# Altium schematic sheet Hbridge.SchDoc
size A
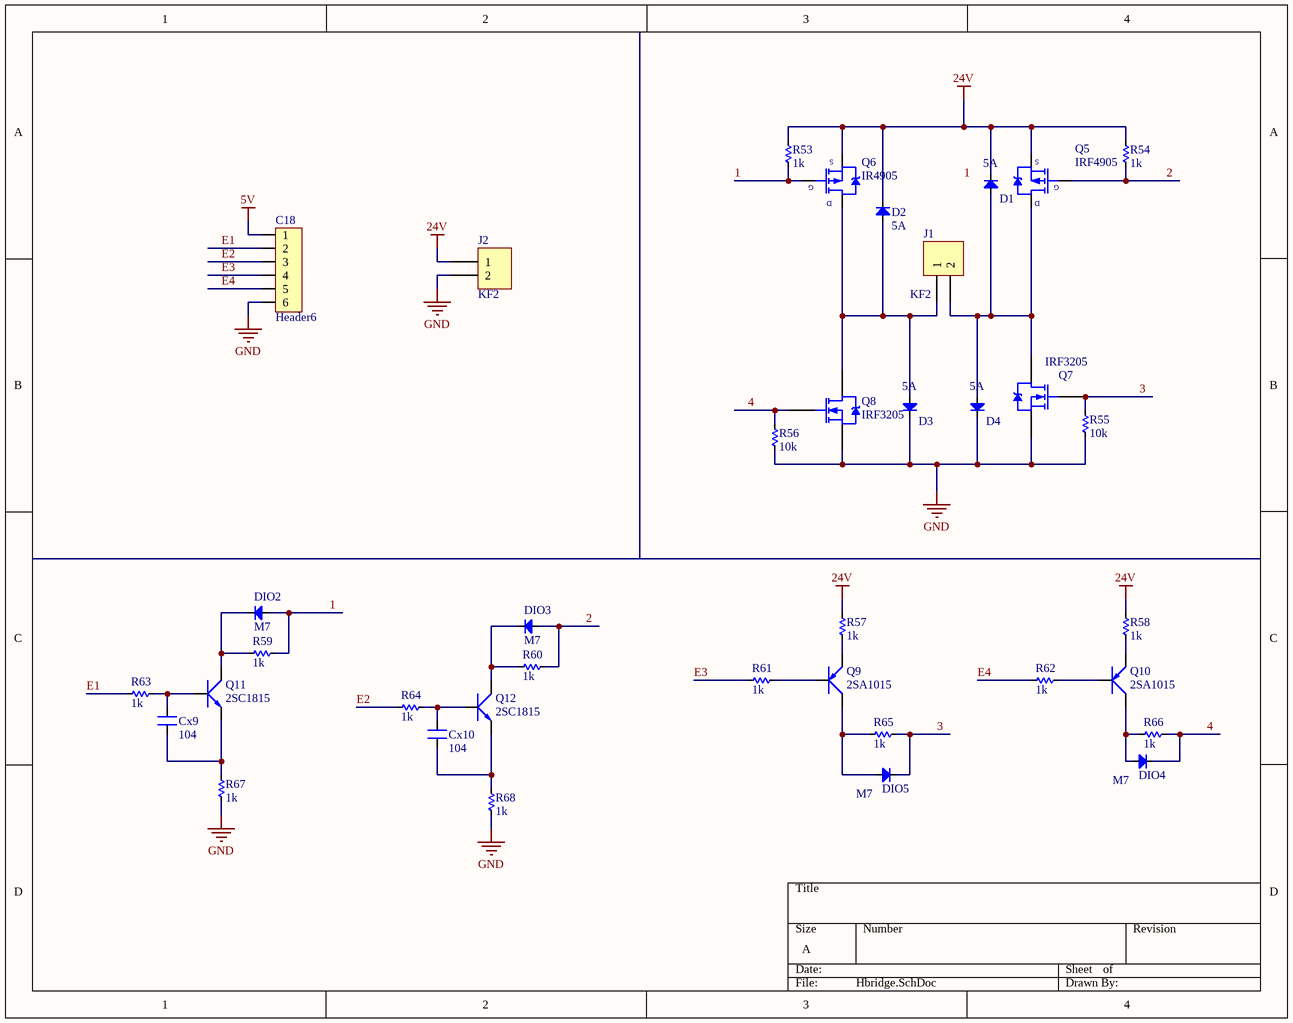
[diagram p0: Hbridge.SchDoc]

## Parts
C18  Header6  [HDR6]
Cx9  104  [CN-SMD-0805]
Cx10  104  [CN-SMD-0805]
D1  5A  [DIO-5A]
D2  5A  [DIO-5A]
D3  5A  [DIO-5A]
D4  5A  [DIO-5A]
DIO2  M7  [DIO-SMD-106]
DIO3  M7  [DIO-SMD-106]
DIO4  M7  [DIO-SMD-106]
DIO5  M7  [DIO-SMD-106]
J1  KF2  [KF2-7.62]
J2  KF2  [KF2-7.62]
Q5  IRF4905  [TO220-123]
Q6  IR4905  [TO220-123]
Q7  IRF3205  [TO220-123]
Q8  IRF3205  [TO220-123]
Q9  2SA1015  [SOT23-321]
Q10  2SA1015  [SOT23-321]
Q11  2SC1815  [SOT23-321]
Q12  2SC1815  [SOT23-321]
R53  1k  [RES-1/4W-SMALL]
R54  1k  [RES-1/4W-SMALL]
R55  10k  [RES-1/4W-SMALL]
R56  10k  [RES-1/4W-SMALL]
R57  1k  [RES-SMD-0805]
R58  1k  [RES-SMD-0805]
R59  1k  [RES-SMD-0805]
R60  1k  [RES-SMD-0805]
R61  1k  [RES-SMD-0805]
R62  1k  [RES-SMD-0805]
R63  1k  [RES-SMD-0805]
R64  1k  [RES-SMD-0805]
R65  1k  [RES-SMD-0805]
R66  1k  [RES-SMD-0805]
R67  1k  [RES-SMD-0805]
R68  1k  [RES-SMD-0805]

## Nets
5V: C18.1
24V: D1.2(K) D2.2(K) J2.1 Q5.3(S) Q6.3(S) R53.1 R54.1 R57.1 R58.1
GND: C18.6 D3.2(K) D4.2(K) J2.2 Q7.3(S) Q8.3(S) R55.2 R56.2 R67.2 R68.2
1: DIO2.1(A) Q6.1(G) R53.2 R59.1
2: DIO3.1(A) Q5.1(G) R54.2 R60.1
3: DIO5.2(K) Q7.1(G) R55.1 R65.1
4: DIO4.2(K) Q8.1(G) R56.1 R66.1
E1: C18.2 R63.2
E2: C18.3 R64.2
E3: C18.4 R61.2
E4: C18.5 R62.2
NetCx9_1: Cx9.1 Q11.1(E) R67.1
NetCx9_2: Cx9.2 Q11.3(B) R63.1
NetCx10_1: Cx10.1 Q12.1(E) R68.1
NetCx10_2: Cx10.2 Q12.3(B) R64.1
NetD1_1: D1.1(A) D4.1(A) J1.2 Q5.2(D) Q7.2(D)
NetD2_1: D2.1(A) D3.1(A) J1.1 Q6.2(D) Q8.2(D)
NetDIO2_2: DIO2.2(K) Q11.2(C) R59.2
NetDIO3_2: DIO3.2(K) Q12.2(C) R60.2
NetDIO4_1: DIO4.1(A) Q10.2(C) R66.2
NetDIO5_1: DIO5.1(A) Q9.2(C) R65.2
NetQ9_1: Q9.1(E) R57.2
NetQ9_3: Q9.3(B) R61.1
NetQ10_1: Q10.1(E) R58.2
NetQ10_3: Q10.3(B) R62.1

## Notes on the sheet
- Labels drawn without touching a wire or pin: 1

## Library data of the parts
C18 = Header6: Header IDC, 6 x 1 Pin Vertical 2.54mm Pitch (Non-Boxed, Male); Manufacturer: W¨¹rth Elektronik eiSos GmbH; partNo: 613002143121; ComponentLink1 Description: Manufacturer; ComponentLink2 Description: Datasheet; NoPins: 02; Created Date: 29 March 2013; ComponentLink1URL: http://www.we-online.com; ComponentLink2URL: http://katalog.we-online.de/em/datasheet/6130xx143121.pdf; Created by: Karrer Zheng
Cx9 Cx10 = CN: Value: 33pF
D1-D4 = Diode: Default Diode TMS; Code - JEDEC: DO-214-AB; Value: 1N5007; Published: 8-Jun-2000; Revision: July-2002: Re-released for DXP Platform.; Publisher: Altium Limited
DIO2-DIO5 = Diode SMD: Default Diode; Code - JEDEC: DO-214-AB; Value: 1N5007; Published: 8-Jun-2000; Revision: July-2002: Re-released for DXP Platform.; Publisher: Altium Limited
J1 J2 = KF2: Manufacturer: Würth Elektronik eiSos GmbH; partNo: 691103110002; ComponentLink1 Description: Manufacturer; ComponentLink2 Description: Datasheet; NoPins: 2; Created Date: 29 October 2013; ComponentLink1URL: http://www.we-online.com; ComponentLink2URL: http://katalog.we-online.de/em/datasheet/6911031100xx.pdf; Created by: Karrer Zheng
Q5 Q6 = IRF9540: HEXFET P-Channel Power MOSFET; Value: IRF840
Q7 Q8 = IRFZ44: Value: IRF840
Q9 Q10 = 2SA1015: PNP 600mW, ECB; Value: A1015
Q11 Q12 = 2SC1815: NPN 600mW, ECB; Value: C1815
R53-R56 = Res: Manufacturer: Generic Components; Class: Passive; SubClass: R; Published: 08/06/2000; Publisher: Altium Hobart Technology Centre
R57-R68 = Res-SMD: Resistor; Manufacturer: Generic Components; Class: Passive; Published: 08/06/2000; Publisher: Altium Hobart Technology Centre